# Altium schematic sheet FMC connector.SchDoc: FMC_ADC
size 420 x 297 mm; Author: G.Kasprowicz; CompanyName: WUT ISE; DrawnBy: G.Kasprowicz; Organization: WUT ISE; Address1: PW ISE; Address2: Nowowiejska 15/19 00-665 Warsaw; Address3: gkasprow@gmail.com; DocumentNumber: 7; Revision: 2; SheetNumber: 7; SheetTotal: 12; ModifiedBy: -; CheckedDate: -; Title2: FMC HPC connector; DivGrp: WUT ISE; Designer: G.Kasprowicz; ModifiedDate: -; ProjectName: Sensor Box
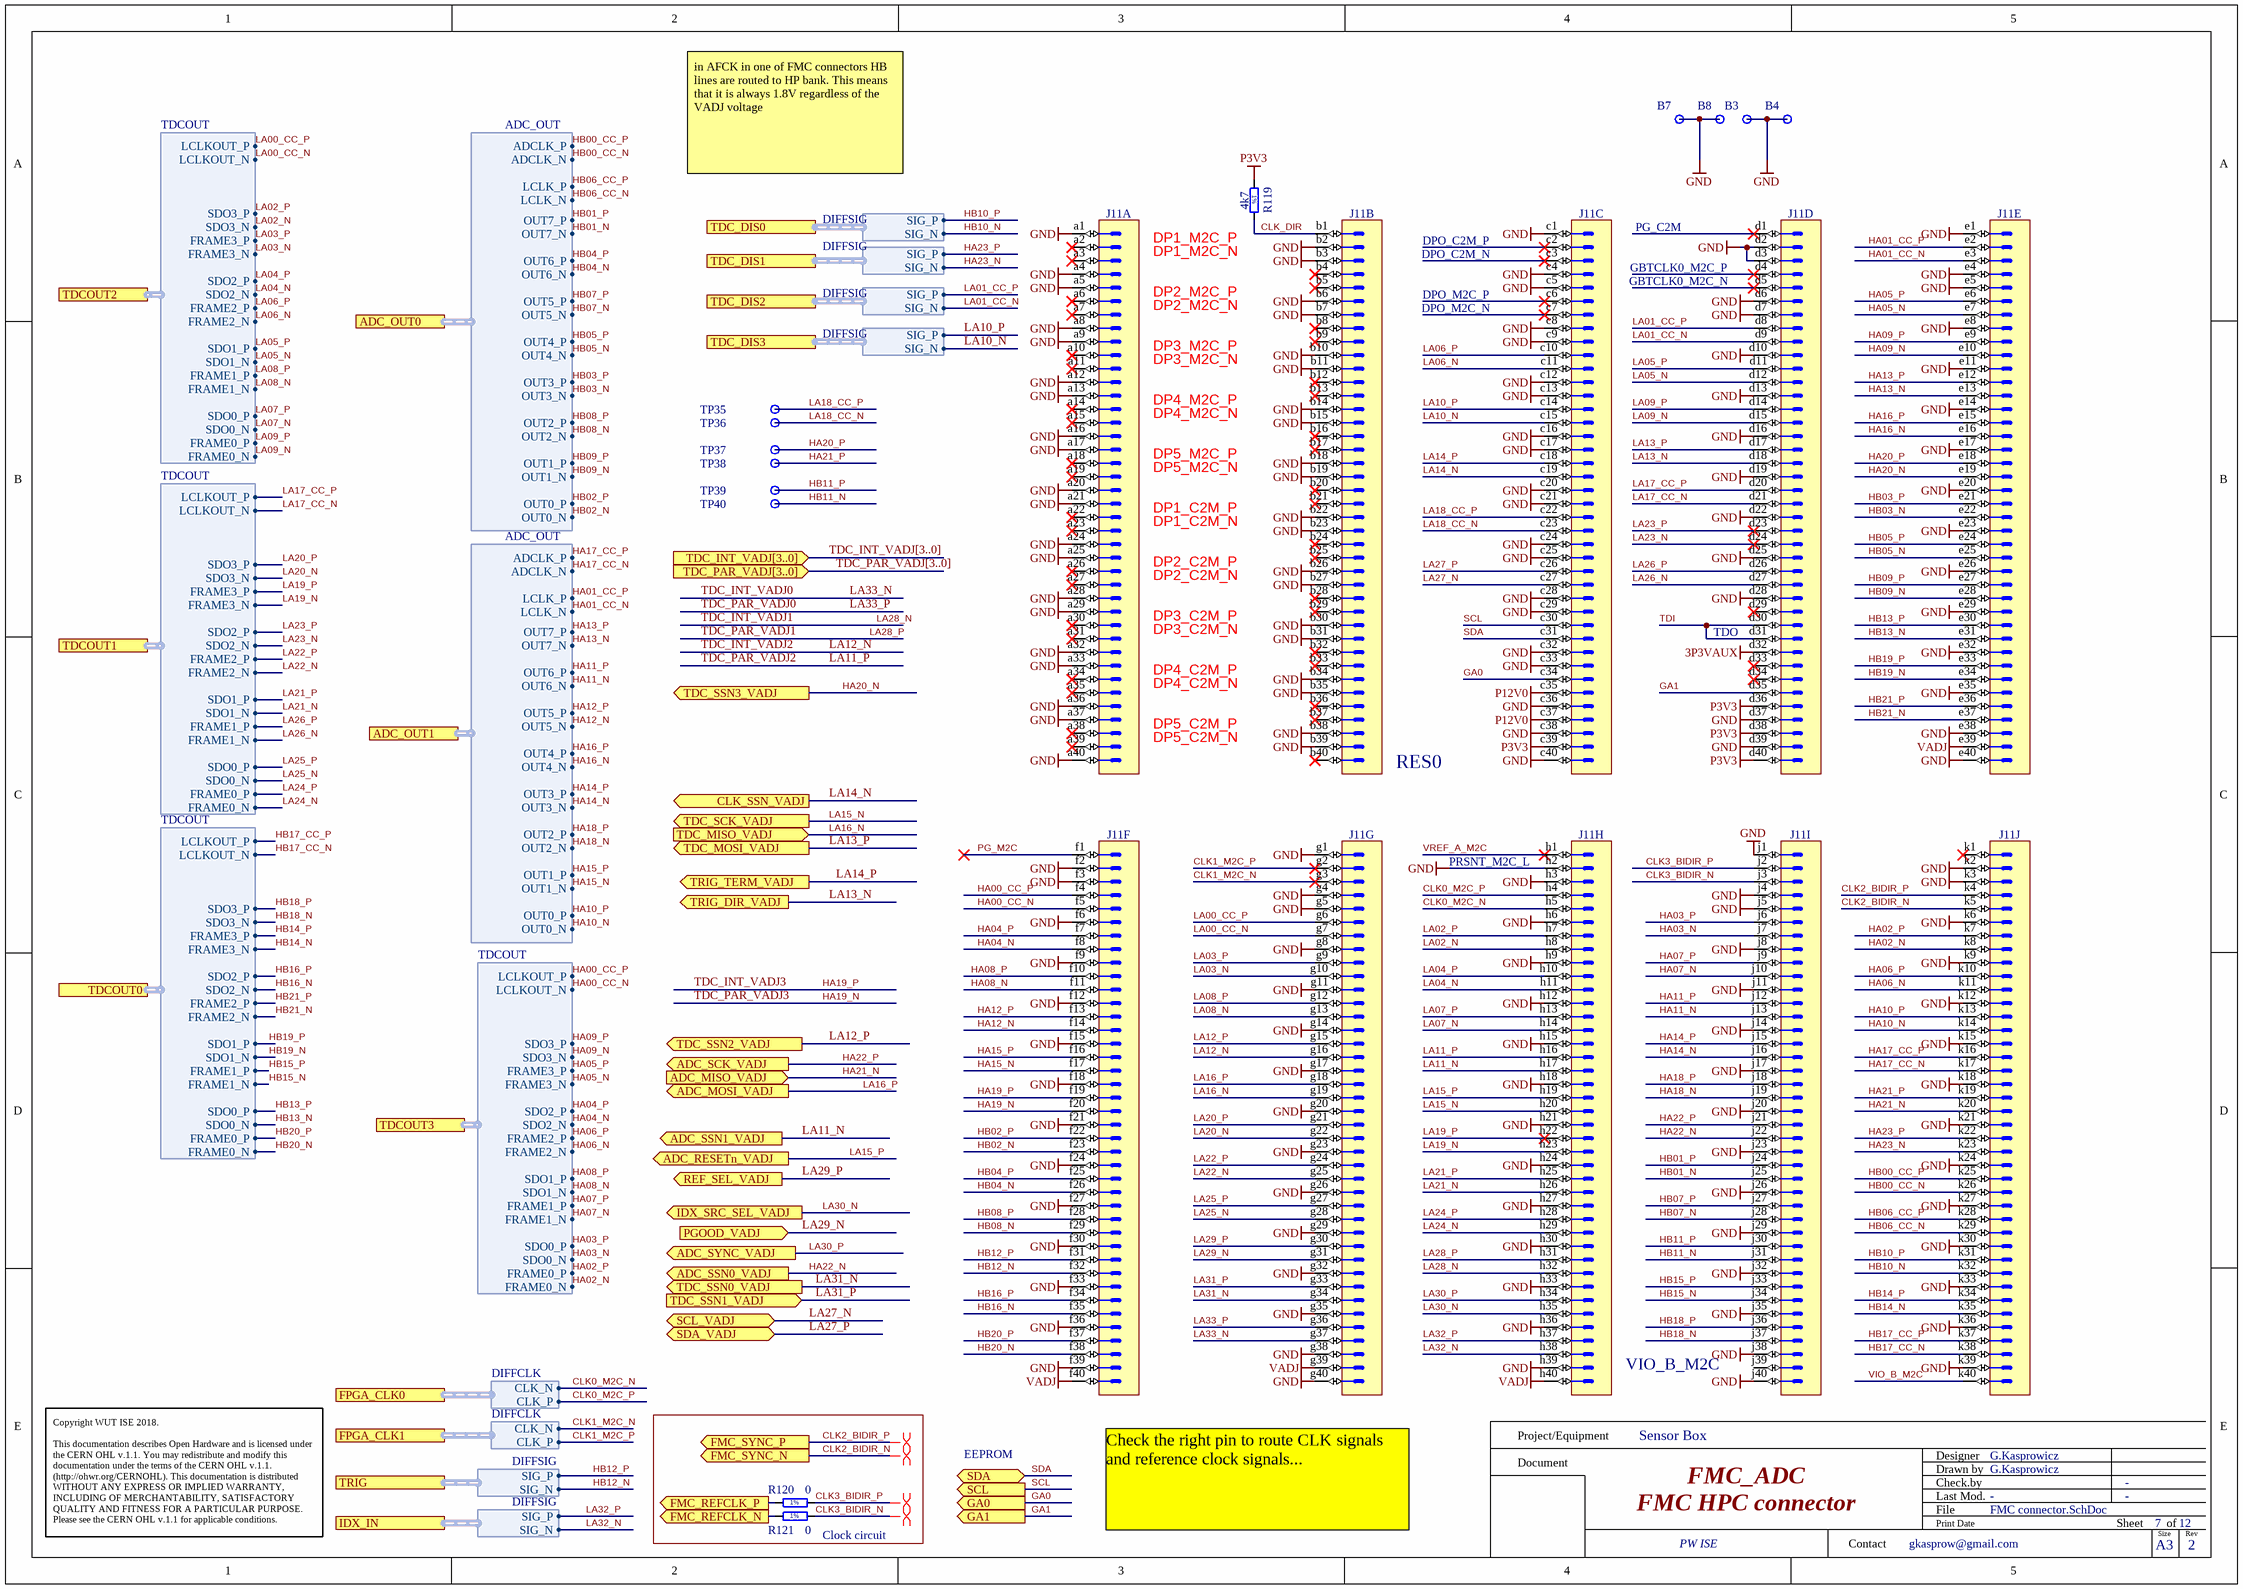
[diagram p0: FMC connector.SchDoc]

## Parts
B3  Plated Hole  [MTG300_600]  (value not drawn)
B4  Plated Hole  [MTG300_600]  (value not drawn)
B7  Plated Hole  [MTG300_600]  (value not drawn)
B8  Plated Hole  [MTG300_600]  (value not drawn)
J11  VITA 57  [SAMTEC_ASP-134488-01]  (value not drawn)  (parts A,B,C,D,E,F,G,H,I,J of 10)
R119  4k7  [RESC1608X55N]
R120  0  [RESC1005X40N]
R121  0  [RESC1005X40N]
TP35  Test Point  [TPS127]  (value not drawn)
TP36  Test Point  [TPS127]  (value not drawn)
TP37  Test Point  [TPS127]  (value not drawn)
TP38  Test Point  [TPS127]  (value not drawn)
TP39  Test Point  [TPS127]  (value not drawn)
TP40  Test Point  [TPS127]  (value not drawn)

## Blocks framed on the sheet
Clock circuit: R120 R121

## Ports
ADC_MISO_VADJ (in), ADC_MOSI_VADJ (out), ADC_OUT0 (harness ADC_OUT), ADC_OUT1 (harness ADC_OUT), ADC_RESETn_VADJ (out), ADC_SCK_VADJ (out), ADC_SSN0_VADJ (out), ADC_SSN1_VADJ (out), ADC_SYNC_VADJ (out), CLK_SSN_VADJ (out), FMC_REFCLK_N (out), FMC_REFCLK_P (out), FMC_SYNC_N (out), FMC_SYNC_P (out), FPGA_CLK0 (harness DIFFCLK), FPGA_CLK1 (harness DIFFCLK), GA0 (out), GA1 (out), IDX_IN (harness DIFFSIG), IDX_SRC_SEL_VADJ (out), PGOOD_VADJ (in), REF_SEL_VADJ (out), SCL (out), SCL_VADJ (bidir), SDA (bidir), SDA_VADJ (bidir), TDC_DIS0 (harness DIFFSIG), TDC_DIS1 (harness DIFFSIG), TDC_DIS2 (harness DIFFSIG), TDC_DIS3 (harness DIFFSIG), TDC_INT_VADJ[3..0] (in), TDC_MISO_VADJ (in), TDC_MOSI_VADJ (out), TDC_PAR_VADJ[3..0] (in), TDC_SCK_VADJ (out), TDC_SSN0_VADJ (out), TDC_SSN1_VADJ (in), TDC_SSN2_VADJ (out), TDC_SSN3_VADJ (out), TDCOUT0 (harness TDCOUT), TDCOUT1 (harness TDCOUT), TDCOUT2 (harness TDCOUT), TDCOUT3 (harness TDCOUT), TRIG (harness DIFFSIG), TRIG_DIR_VADJ (out), TRIG_TERM_VADJ (out)

## Harnesses
TDCOUT: FRAME0_N, FRAME0_P, SDO0_N, SDO0_P, FRAME1_N, FRAME1_P, SDO1_N, SDO1_P, FRAME2_N, FRAME2_P, SDO2_N, SDO2_P, FRAME3_N, FRAME3_P, SDO3_N, SDO3_P, LCLKOUT_N, LCLKOUT_P
ADC_OUT: LCLK_N, ADCLK_N, OUT7_N, OUT6_N, OUT5_N, OUT4_N, OUT3_N, OUT2_N, OUT1_N, OUT0_N, LCLK_P, ADCLK_P, OUT7_P, OUT6_P, OUT5_P, OUT4_P, OUT3_P, OUT2_P, OUT1_P, OUT0_P
DIFFCLK: CLK_P, CLK_N
DIFFSIG: SIG_N, SIG_P

## Nets
3P3VAUX: J11.d32
GND: B3.1 B4.1 B7.1 B8.1 J11.a1 J11.a4 J11.a5 J11.a8 J11.a9 J11.a12 J11.a13 J11.a16 J11.a17 J11.a20 J11.a21 J11.a24 J11.a25 J11.a28 J11.a29 J11.a32 J11.a33 J11.a36 J11.a37 J11.a40 J11.b2 J11.b3 J11.b6 J11.b7 J11.b10 J11.b11 J11.b14 J11.b15 J11.b18 J11.b19 J11.b22 J11.b23 J11.b26 J11.b27 J11.b30 J11.b31 J11.b34 J11.b35 J11.b38 J11.b39 J11.c1 J11.c4 J11.c5 J11.c8 J11.c9 J11.c12 J11.c13 J11.c16 J11.c17 J11.c20 J11.c21 J11.c24 J11.c25 J11.c28 J11.c29 J11.c32 J11.c33 J11.c36 J11.c38 J11.c40 J11.d2 J11.d3 J11.d6 J11.d7 J11.d10 J11.d13 J11.d16 J11.d19 J11.d22 J11.d25 J11.d28 J11.d37 J11.d39 J11.e1 J11.e4 J11.e5 J11.e8 J11.e11 J11.e14 J11.e17 J11.e20 J11.e23 J11.e26 J11.e29 J11.e32 J11.e35 J11.e38 J11.e40 J11.f2 J11.f3 J11.f6 J11.f9 J11.f12 J11.f15 J11.f18 J11.f21 J11.f24 J11.f27 J11.f30 J11.f33 J11.f36 J11.f39 J11.g1 J11.g4 J11.g5 J11.g8 J11.g11 J11.g14 J11.g17 J11.g20 J11.g23 J11.g26 J11.g29 J11.g32 J11.g35 J11.g38 J11.g40 J11.h2 J11.h3 J11.h6 J11.h9 J11.h12 J11.h15 J11.h18 J11.h21 J11.h24 J11.h27 J11.h30 J11.h33 J11.h36 J11.h39 J11.j1 J11.j4 J11.j5 J11.j8 J11.j11 J11.j14 J11.j17 J11.j20 J11.j23 J11.j26 J11.j29 J11.j32 J11.j35 J11.j38 J11.j40 J11.k2 J11.k3 J11.k6 J11.k9 J11.k12 J11.k15 J11.k18 J11.k21 J11.k24 J11.k27 J11.k30 J11.k33 J11.k36 J11.k39
P3V3: J11.c39 J11.d36 J11.d38 J11.d40 R119.1
P12V0: J11.c35 J11.c37
VADJ: J11.e39 J11.f40 J11.g39 J11.h40
CLK0_M2C_N: J11.h5 ; port FPGA_CLK0.CLK_N
CLK0_M2C_P: J11.h4 ; port FPGA_CLK0.CLK_P
CLK1_M2C_N: J11.g3 ; port FPGA_CLK1.CLK_N
CLK1_M2C_P: J11.g2 ; port FPGA_CLK1.CLK_P
CLK2_BIDIR_N: J11.k5 ; port FMC_SYNC_N
CLK2_BIDIR_P: J11.k4 ; port FMC_SYNC_P
CLK3_BIDIR_N: J11.j3 R121.2
CLK3_BIDIR_P: J11.j2 R120.2
CLK_DIR: J11.b1 R119.2
FMC_REFCLK_N: R121.1 ; port FMC_REFCLK_N
FMC_REFCLK_P: R120.1 ; port FMC_REFCLK_P
GA0: J11.c34 ; port GA0
GA1: J11.d35 ; port GA1
HA00_CC_N: J11.f5 ; port TDCOUT3.LCLKOUT_N
HA00_CC_P: J11.f4 ; port TDCOUT3.LCLKOUT_P
HA01_CC_N: J11.e3 ; port ADC_OUT1.LCLK_N
HA01_CC_P: J11.e2 ; port ADC_OUT1.LCLK_P
HA02_N: J11.k8 ; port TDCOUT3.FRAME0_N
HA02_P: J11.k7 ; port TDCOUT3.FRAME0_P
HA03_N: J11.j7 ; port TDCOUT3.SDO0_N
HA03_P: J11.j6 ; port TDCOUT3.SDO0_P
HA04_N: J11.f8 ; port TDCOUT3.SDO2_N
HA04_P: J11.f7 ; port TDCOUT3.SDO2_P
HA05_N: J11.e7 ; port TDCOUT3.FRAME3_N
HA05_P: J11.e6 ; port TDCOUT3.FRAME3_P
HA06_N: J11.k11 ; port TDCOUT3.FRAME2_N
HA06_P: J11.k10 ; port TDCOUT3.FRAME2_P
HA07_N: J11.j10 ; port TDCOUT3.FRAME1_N
HA07_P: J11.j9 ; port TDCOUT3.FRAME1_P
HA08_N: J11.f11 ; port TDCOUT3.SDO1_N
HA08_P: J11.f10 ; port TDCOUT3.SDO1_P
HA09_N: J11.e10 ; port TDCOUT3.SDO3_N
HA09_P: J11.e9 ; port TDCOUT3.SDO3_P
HA10_N: J11.k14 ; port ADC_OUT1.OUT0_N
HA10_P: J11.k13 ; port ADC_OUT1.OUT0_P
HA11_N: J11.j13 ; port ADC_OUT1.OUT6_N
HA11_P: J11.j12 ; port ADC_OUT1.OUT6_P
HA12_N: J11.f14 ; port ADC_OUT1.OUT5_N
HA12_P: J11.f13 ; port ADC_OUT1.OUT5_P
HA13_N: J11.e13 ; port ADC_OUT1.OUT7_N
HA13_P: J11.e12 ; port ADC_OUT1.OUT7_P
HA14_N: J11.j16 ; port ADC_OUT1.OUT3_N
HA14_P: J11.j15 ; port ADC_OUT1.OUT3_P
HA15_N: J11.f17 ; port ADC_OUT1.OUT1_N
HA15_P: J11.f16 ; port ADC_OUT1.OUT1_P
HA16_N: J11.e16 ; port ADC_OUT1.OUT4_N
HA16_P: J11.e15 ; port ADC_OUT1.OUT4_P
HA17_CC_N: J11.k17 ; port ADC_OUT1.ADCLK_N
HA17_CC_P: J11.k16 ; port ADC_OUT1.ADCLK_P
HA18_N: J11.j19 ; port ADC_OUT1.OUT2_N
HA18_P: J11.j18 ; port ADC_OUT1.OUT2_P
HA19_N: J11.f20  [also labelled TDC_PAR_VADJ3]
HA19_P: J11.f19  [also labelled TDC_INT_VADJ3]
HA20_N: J11.e19 ; port TDC_SSN3_VADJ
HA20_P: J11.e18 TP37.1
HA21_N: J11.k20 ; port ADC_MISO_VADJ
HA21_P: J11.k19 TP38.1
HA22_N: J11.j22 ; port ADC_SSN0_VADJ
HA22_P: J11.j21 ; port ADC_SCK_VADJ
HA23_N: J11.k23 ; port TDC_DIS1.SIG_N
HA23_P: J11.k22 ; port TDC_DIS1.SIG_P
HB00_CC_N: J11.k26 ; port ADC_OUT0.ADCLK_N
HB00_CC_P: J11.k25 ; port ADC_OUT0.ADCLK_P
HB01_N: J11.j25 ; port ADC_OUT0.OUT7_N
HB01_P: J11.j24 ; port ADC_OUT0.OUT7_P
HB02_N: J11.f23 ; port ADC_OUT0.OUT0_N
HB02_P: J11.f22 ; port ADC_OUT0.OUT0_P
HB03_N: J11.e22 ; port ADC_OUT0.OUT3_N
HB03_P: J11.e21 ; port ADC_OUT0.OUT3_P
HB04_N: J11.f26 ; port ADC_OUT0.OUT6_N
HB04_P: J11.f25 ; port ADC_OUT0.OUT6_P
HB05_N: J11.e25 ; port ADC_OUT0.OUT4_N
HB05_P: J11.e24 ; port ADC_OUT0.OUT4_P
HB06_CC_N: J11.k29 ; port ADC_OUT0.LCLK_N
HB06_CC_P: J11.k28 ; port ADC_OUT0.LCLK_P
HB07_N: J11.j28 ; port ADC_OUT0.OUT5_N
HB07_P: J11.j27 ; port ADC_OUT0.OUT5_P
HB08_N: J11.f29 ; port ADC_OUT0.OUT2_N
HB08_P: J11.f28 ; port ADC_OUT0.OUT2_P
HB09_N: J11.e28 ; port ADC_OUT0.OUT1_N
HB09_P: J11.e27 ; port ADC_OUT0.OUT1_P
HB10_N: J11.k32 ; port TDC_DIS0.SIG_N
HB10_P: J11.k31 ; port TDC_DIS0.SIG_P
HB11_N: J11.j31 TP40.1
HB11_P: J11.j30 TP39.1
HB12_N: J11.f32 ; port TRIG.SIG_N
HB12_P: J11.f31 ; port TRIG.SIG_P
HB13_N: J11.e31 ; port TDCOUT0.SDO0_N
HB13_P: J11.e30 ; port TDCOUT0.SDO0_P
HB14_N: J11.k35 ; port TDCOUT0.FRAME3_N
HB14_P: J11.k34 ; port TDCOUT0.FRAME3_P
HB15_N: J11.j34 ; port TDCOUT0.FRAME1_N
HB15_P: J11.j33 ; port TDCOUT0.FRAME1_P
HB16_N: J11.f35 ; port TDCOUT0.SDO2_N
HB16_P: J11.f34 ; port TDCOUT0.SDO2_P
HB17_CC_N: J11.k38 ; port TDCOUT0.LCLKOUT_N
HB17_CC_P: J11.k37 ; port TDCOUT0.LCLKOUT_P
HB18_N: J11.j37 ; port TDCOUT0.SDO3_N
HB18_P: J11.j36 ; port TDCOUT0.SDO3_P
HB19_N: J11.e34 ; port TDCOUT0.SDO1_N
HB19_P: J11.e33 ; port TDCOUT0.SDO1_P
HB20_N: J11.f38 ; port TDCOUT0.FRAME0_N
HB20_P: J11.f37 ; port TDCOUT0.FRAME0_P
HB21_N: J11.e37 ; port TDCOUT0.FRAME2_N
HB21_P: J11.e36 ; port TDCOUT0.FRAME2_P
LA00_CC_N: J11.g7 ; port TDCOUT2.LCLKOUT_N
LA00_CC_P: J11.g6 ; port TDCOUT2.LCLKOUT_P
LA01_CC_N: J11.d9 ; port TDC_DIS2.SIG_N
LA01_CC_P: J11.d8 ; port TDC_DIS2.SIG_P
LA02_N: J11.h8 ; port TDCOUT2.SDO3_N
LA02_P: J11.h7 ; port TDCOUT2.SDO3_P
LA03_N: J11.g10 ; port TDCOUT2.FRAME3_N
LA03_P: J11.g9 ; port TDCOUT2.FRAME3_P
LA04_N: J11.h11 ; port TDCOUT2.SDO2_N
LA04_P: J11.h10 ; port TDCOUT2.SDO2_P
LA05_N: J11.d12 ; port TDCOUT2.SDO1_N
LA05_P: J11.d11 ; port TDCOUT2.SDO1_P
LA06_N: J11.c11 ; port TDCOUT2.FRAME2_N
LA06_P: J11.c10 ; port TDCOUT2.FRAME2_P
LA07_N: J11.h14 ; port TDCOUT2.SDO0_N
LA07_P: J11.h13 ; port TDCOUT2.SDO0_P
LA08_N: J11.g13 ; port TDCOUT2.FRAME1_N
LA08_P: J11.g12 ; port TDCOUT2.FRAME1_P
LA09_N: J11.d15 ; port TDCOUT2.FRAME0_N
LA09_P: J11.d14 ; port TDCOUT2.FRAME0_P
LA10_N: J11.c15 ; port TDC_DIS3.SIG_N
LA10_P: J11.c14 ; port TDC_DIS3.SIG_P
LA11_N: J11.h17 ; port ADC_SSN1_VADJ
LA11_P: J11.h16  [also labelled TDC_PAR_VADJ2]
LA12_N: J11.g16  [also labelled TDC_INT_VADJ2]
LA12_P: J11.g15 ; port TDC_SSN2_VADJ
LA13_N: J11.d18 ; port TRIG_DIR_VADJ
LA13_P: J11.d17 ; port TDC_MOSI_VADJ
LA14_N: J11.c19 ; port CLK_SSN_VADJ
LA14_P: J11.c18 ; port TRIG_TERM_VADJ
LA15_N: J11.h20 ; port TDC_SCK_VADJ
LA15_P: J11.h19 ; port ADC_RESETn_VADJ
LA16_N: J11.g19 ; port TDC_MISO_VADJ
LA16_P: J11.g18 ; port ADC_MOSI_VADJ
LA17_CC_N: J11.d21 ; port TDCOUT1.LCLKOUT_N
LA17_CC_P: J11.d20 ; port TDCOUT1.LCLKOUT_P
LA18_CC_N: J11.c23 TP36.1
LA18_CC_P: J11.c22 TP35.1
LA19_N: J11.h23 ; port TDCOUT1.FRAME3_N
LA19_P: J11.h22 ; port TDCOUT1.FRAME3_P
LA20_N: J11.g22 ; port TDCOUT1.SDO3_N
LA20_P: J11.g21 ; port TDCOUT1.SDO3_P
LA21_N: J11.h26 ; port TDCOUT1.SDO1_N
LA21_P: J11.h25 ; port TDCOUT1.SDO1_P
LA22_N: J11.g25 ; port TDCOUT1.FRAME2_N
LA22_P: J11.g24 ; port TDCOUT1.FRAME2_P
LA23_N: J11.d24 ; port TDCOUT1.SDO2_N
LA23_P: J11.d23 ; port TDCOUT1.SDO2_P
LA24_N: J11.h29 ; port TDCOUT1.FRAME0_N
LA24_P: J11.h28 ; port TDCOUT1.FRAME0_P
LA25_N: J11.g28 ; port TDCOUT1.SDO0_N
LA25_P: J11.g27 ; port TDCOUT1.SDO0_P
LA26_N: J11.d27 ; port TDCOUT1.FRAME1_N
LA26_P: J11.d26 ; port TDCOUT1.FRAME1_P
LA27_N: J11.c27 ; port SCL_VADJ
LA27_P: J11.c26 ; port SDA_VADJ
LA28_N: J11.h32  [also labelled TDC_INT_VADJ1]
LA28_P: J11.h31  [also labelled TDC_PAR_VADJ1]
LA29_N: J11.g31 ; port PGOOD_VADJ
LA29_P: J11.g30 ; port REF_SEL_VADJ
LA30_N: J11.h35 ; port IDX_SRC_SEL_VADJ
LA30_P: J11.h34 ; port ADC_SYNC_VADJ
LA31_N: J11.g34 ; port TDC_SSN0_VADJ
LA31_P: J11.g33 ; port TDC_SSN1_VADJ
LA32_N: J11.h38 ; port IDX_IN.SIG_N
LA32_P: J11.h37 ; port IDX_IN.SIG_P
LA33_N: J11.g37  [also labelled TDC_INT_VADJ0]
LA33_P: J11.g36  [also labelled TDC_PAR_VADJ0]
PG_M2C: J11.f1
SCL: J11.c30 ; port SCL
SDA: J11.c31 ; port SDA
TDI: J11.d30 J11.d31
VIO_B_M2C: J11.k40
VREF_A_M2C: J11.h1

Not connected (* = marked no-connect by the designer): J11 a2* a3* a6* a7* a10* a11* a14* a15* a18* a19* a22* a23* a26* a27* a30* a31* a34* a35* a38* a39* b4* b5* b8* b9* b12* b13* b16* b17* b20* b21* b24* b25* b28* b29* b32* b33* b36* b37* b40* c2* c3* c6* c7* d1* d4* d5* d29* d33* d34* j39 k1*

## Buses and harness runs
bus TDC_INT_VADJ[3..0] = port TDC_INT_VADJ[3..0]
bus TDC_PAR_VADJ[3..0] = port TDC_PAR_VADJ[3..0]

## Layout directives
differential pair: CLK2_BIDIR_N, CLK2_BIDIR_P, CLK3_BIDIR_N, CLK3_BIDIR_P

## Notes on the sheet
- in AFCK in one of FMC connectors HB lines are routed to HP bank. This means that it is always 1.8V regardless of the VADJ voltage
- DP1_M2C_P
- DP1_M2C_N
- DPO_C2M_P
- DPO_C2M_N
- PG_C2M
- GBTCLK0_M2C_P
- DP2_M2C_P
- DP2_M2C_N
- DPO_M2C_P
- DPO_M2C_N
- GBTCLK0_M2C_N
- DP3_M2C_P
- DP3_M2C_N
- DP4_M2C_P
- DP4_M2C_N
- DP5_M2C_P
- DP5_M2C_N
- DP1_C2M_P
- DP1_C2M_N
- DP2_C2M_P
- DP2_C2M_N
- DP3_C2M_P
- DP3_C2M_N
- (near J11) TDO
- DP4_C2M_P
- DP4_C2M_N
- DP5_C2M_P
- DP5_C2M_N
- RES0
- (near J11) PRSNT_M2C_L
- VIO_B_M2C
- EEPROM
- (near J11) Check the right pin to route CLK signals and reference clock signals...
- Project/Equipment
- Document
- Designer
- Drawn by
- Check.by
- Copyright WUT ISE 2018.
  This documentation describes Open Hardware and is licensed under the CERN OHL v.1.1. You may redistribute and modify this documentation under the terms of the CERN OHL v.1.1. (http://ohwr.org/CERNOHL). This documentation is distributed WITHOUT ANY EXPRESS OR IMPLIED WARRANTY, INCLUDING OF MERCHANTABILITY, SATISFACTORY QUALITY AND FITNESS FOR A PARTICULAR PURPOSE. Please see the CERN OHL v.1.1 for applicable conditions.
- Contact
- File
- Last Mod.
- Print Date
- Sheet
- Size
- A3
- of
- Rev
- (in symbol R0402_0R_JUMPER) 1%
- (in symbol R0603_4K7_1%_0.1W_100PPM) 1%

## Library data of the parts
B3 B4 B7 B8 = PLATED_HOLE3.0_PAD6.0: Single Terminal Socket; Part Description: Plated Through Hole: Hole Dia.=3.0mm Pad Dia.=6.0mm; Mounted: No; Table: Pads; Part Number: PLATED_HOLE3.0_PAD6.0; Component Kind: Standard (No BOM); Component Type: Standard (No BOM); Designator: Single Terminal Socket; Library Reference: Single Terminal Socket; Pin Count: 1; Family: Plated Hole; Socket: No; SMD: No; Status: None; ComponentHeight: 0mm; Author: CERN DEM JLC; CreateDate: 26.05.2008; LatestRevisionDate: 26.05.2008; PackageDescription: Plated Through Hole: Hole Dia.=3.0mm Pad Dia.=6.0mm
J11 = SAMTEC_ASP-134488-01: Connector VITA 57, 400 Male contacts in 10 row abcdefghj; Part Description: 400 contacts (10 rows abcdefghj) Surface Mount Male Connector, VITA 57 (MC-HPC-10); Manufacturer: SAMTEC; Part Number: SAMTEC_ASP-134488-01; Component Kind: Standard; Component Type: Standard; Pin Count: 400; Family: VITA 57; Mounted: Yes; Socket: No; SMD: Yes; Status: None; Manufacturer Part Number: ASP-134488-01; ComponentHeight: 6.1mm; HelpURL: \\cern.ch\dfs\Applications\Altium\Datasheets\SAMTEC_ASP-134488-01.pdf; Author: CERN DEM JLC; CreateDate: 30/04/2009; LatestRevisionDate: 17/08/2009; Table: SAMTEC
R119 = R0603_4K7_1%_0.1W_100PPM: Resistor - 1%; Part Description: General Purpose Thick Film Chip Resistor; Manufacturer: GENERIC; Manufacturer1 Part Number: NRC06F4701TRF; Power: 0.1W; TC: ±100ppm/°C; Table: Resistors SMD; Part Number: R0603_4K7_1%_0.1W_100PPM; Component Kind: Standard; Component Type: Standard; Pin Count: 2; Value: 4k7; Status: Preferred; Tolerance: ±1%; Manufacturer Part Number: R0603_4K7_1%_0.1W_100PPM; Case: 0603; Mounted: Yes; Socket: No; SMD: Yes; Manufacturer1 Example: NIC COMPONENT; Manufacturer1 ComponentHeight: 0.55mm; HelpURL: \\cern.ch\dfs\Applications\Altium\Datasheets\R0603_NIC_NRC.pdf; Author: CERN DEM JLC; CreateDate: 03/12/2007; LatestRevisionDate: 13/03/2008
R120 R121 = R0402_0R_JUMPER: Resistor - 1%; Part Description: 1A (0.05R Max DC Resistance) Zero Ohm Jumper; Manufacturer: GENERIC; Manufacturer1 Part Number: 232270591001L; Table: Resistors SMD; Part Number: R0402_0R_JUMPER; Component Kind: Standard; Component Type: Standard; Pin Count: 2; Value: 0; Status: Not recommended; Manufacturer Part Number: R0402_0R_JUMPER; Case: 0402; Mounted: Yes; Socket: No; SMD: Yes; Manufacturer1 Example: YAGEO PHYCOMP; Manufacturer1 ComponentHeight: 0.4mm; HelpURL: \\cern.ch\dfs\Applications\Altium\Datasheets\R0402_Phycomp_RC0402.pdf; Author: CERN DEM JLC; CreateDate: 3/12/2007; LatestRevisionDate: 17/10/2012
TP35-TP40 = SMD_PAD_1.27X1.27MM: Part Description: 1.27mm x 1.27mm PCB Copper Area (SMD Test Point); Mounted: No; Part Number: SMD_PAD_1.27X1.27MM; Component Kind: Standard (No BOM); Component Type: Standard (No BOM); Pin Count: 1; Family: Test Point; Socket: No; SMD: Yes; Sense: No; Status: None; ComponentHeight: 0mm; HelpURL: Undefined; Author: CERN DEM JLC; CreateDate: 12.01.2008; LatestRevisionDate: 12.01.2008; PackageDescription: 1.27mm x 1.27mm PCB Copper Area (SMD Test Point)